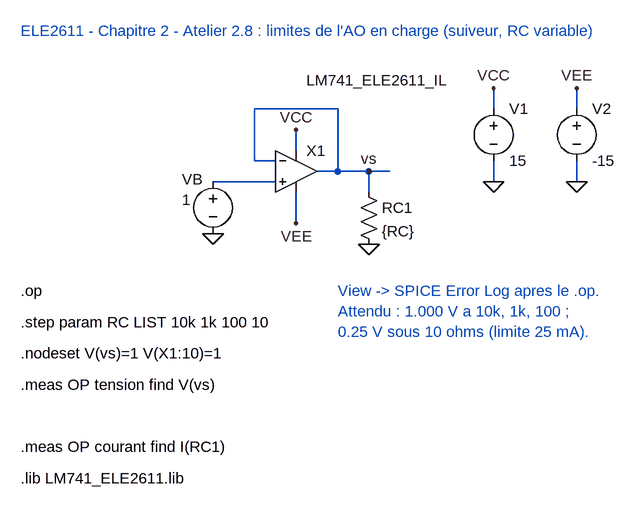
[diagram p0: schematic Ch2_Atelier_2_8_ChargeSortie.asc]
Ch2_Atelier_2_8_ChargeSortie.asc, the LTspice schematic file:
Version 4
SHEET 1 1200 700
WIRE 528 256 560 256
WIRE 560 160 560 256
WIRE 432 160 560 160
WIRE 432 160 432 240
WIRE 432 240 464 240
WIRE 496 192 496 224
WIRE 496 288 496 336
WIRE 560 256 640 256
WIRE 368 272 464 272
WIRE 608 256 608 288
WIRE 800 128 800 160
WIRE 800 240 800 272
WIRE 928 128 928 160
WIRE 928 240 928 272
FLAG 496 192 VCC
FLAG 496 336 VEE
FLAG 368 352 0
FLAG 608 256 vs
FLAG 608 368 0
FLAG 800 128 VCC
FLAG 800 272 0
FLAG 928 128 VEE
FLAG 928 272 0
SYMBOL Opamps\\opamp2 496 192 R0
WINDOW 3 16 -76 Left 2
SYMATTR InstName X1
SYMATTR Value LM741_ELE2611_IL
SYMBOL voltage 368 256 R0
WINDOW 0 -48 12 Left 2
WINDOW 3 -48 44 Left 2
SYMATTR InstName VB
SYMATTR Value 1
SYMBOL res 592 272 R0
SYMATTR InstName RC1
SYMATTR Value {RC}
SYMBOL voltage 800 144 R0
SYMATTR InstName V1
SYMATTR Value 15
SYMBOL voltage 928 144 R0
SYMATTR InstName V2
SYMATTR Value -15
TEXT 72 40 Left 2 ;ELE2611 - Chapitre 2 - Atelier 2.8 : limites de l'AO en charge (suiveur, RC variable)
TEXT 72 440 Left 2 !.op
TEXT 72 488 Left 2 !.step param RC LIST 10k 1k 100 10
TEXT 72 536 Left 2 !.nodeset V(vs)=1 V(X1:10)=1
TEXT 72 584 Left 2 !.meas OP tension find V(vs)
TEXT 72 680 Left 2 !.meas OP courant find I(RC1)
TEXT 72 728 Left 2 !.lib LM741_ELE2611.lib
TEXT 560 440 Left 2 ;View -> SPICE Error Log apres le .op.\nAttendu : 1.000 V a 10k, 1k, 100 ;\n0.25 V sous 10 ohms (limite 25 mA).

The netlist it stands for:
* Ch2_Atelier_2_8_ChargeSortie.asc
XX1 N001 vs VCC VEE vs LM741_ELE2611_IL  ; pins In+ In- V+ V- OUT
VB N001 0 1
RC1 vs 0 {RC}
V1 VCC 0 15
V2 VEE 0 -15
* ELE2611 - Chapitre 2 - Atelier 2.8 : limites de l'AO en charge (suiveur, RC variable)
.op
.step param RC LIST 10k 1k 100 10
.nodeset V(vs)=1 V(X1:10)=1
.meas OP tension find V(vs)
.meas OP courant find I(RC1)
.lib LM741_ELE2611.lib
* View -> SPICE Error Log apres le .op.
* Attendu : 1.000 V a 10k, 1k, 100 ;
* 0.25 V sous 10 ohms (limite 25 mA).
.backanno
.end